# EAGLE design TRRS_Breakout-v10 (EAGLE 6.2)
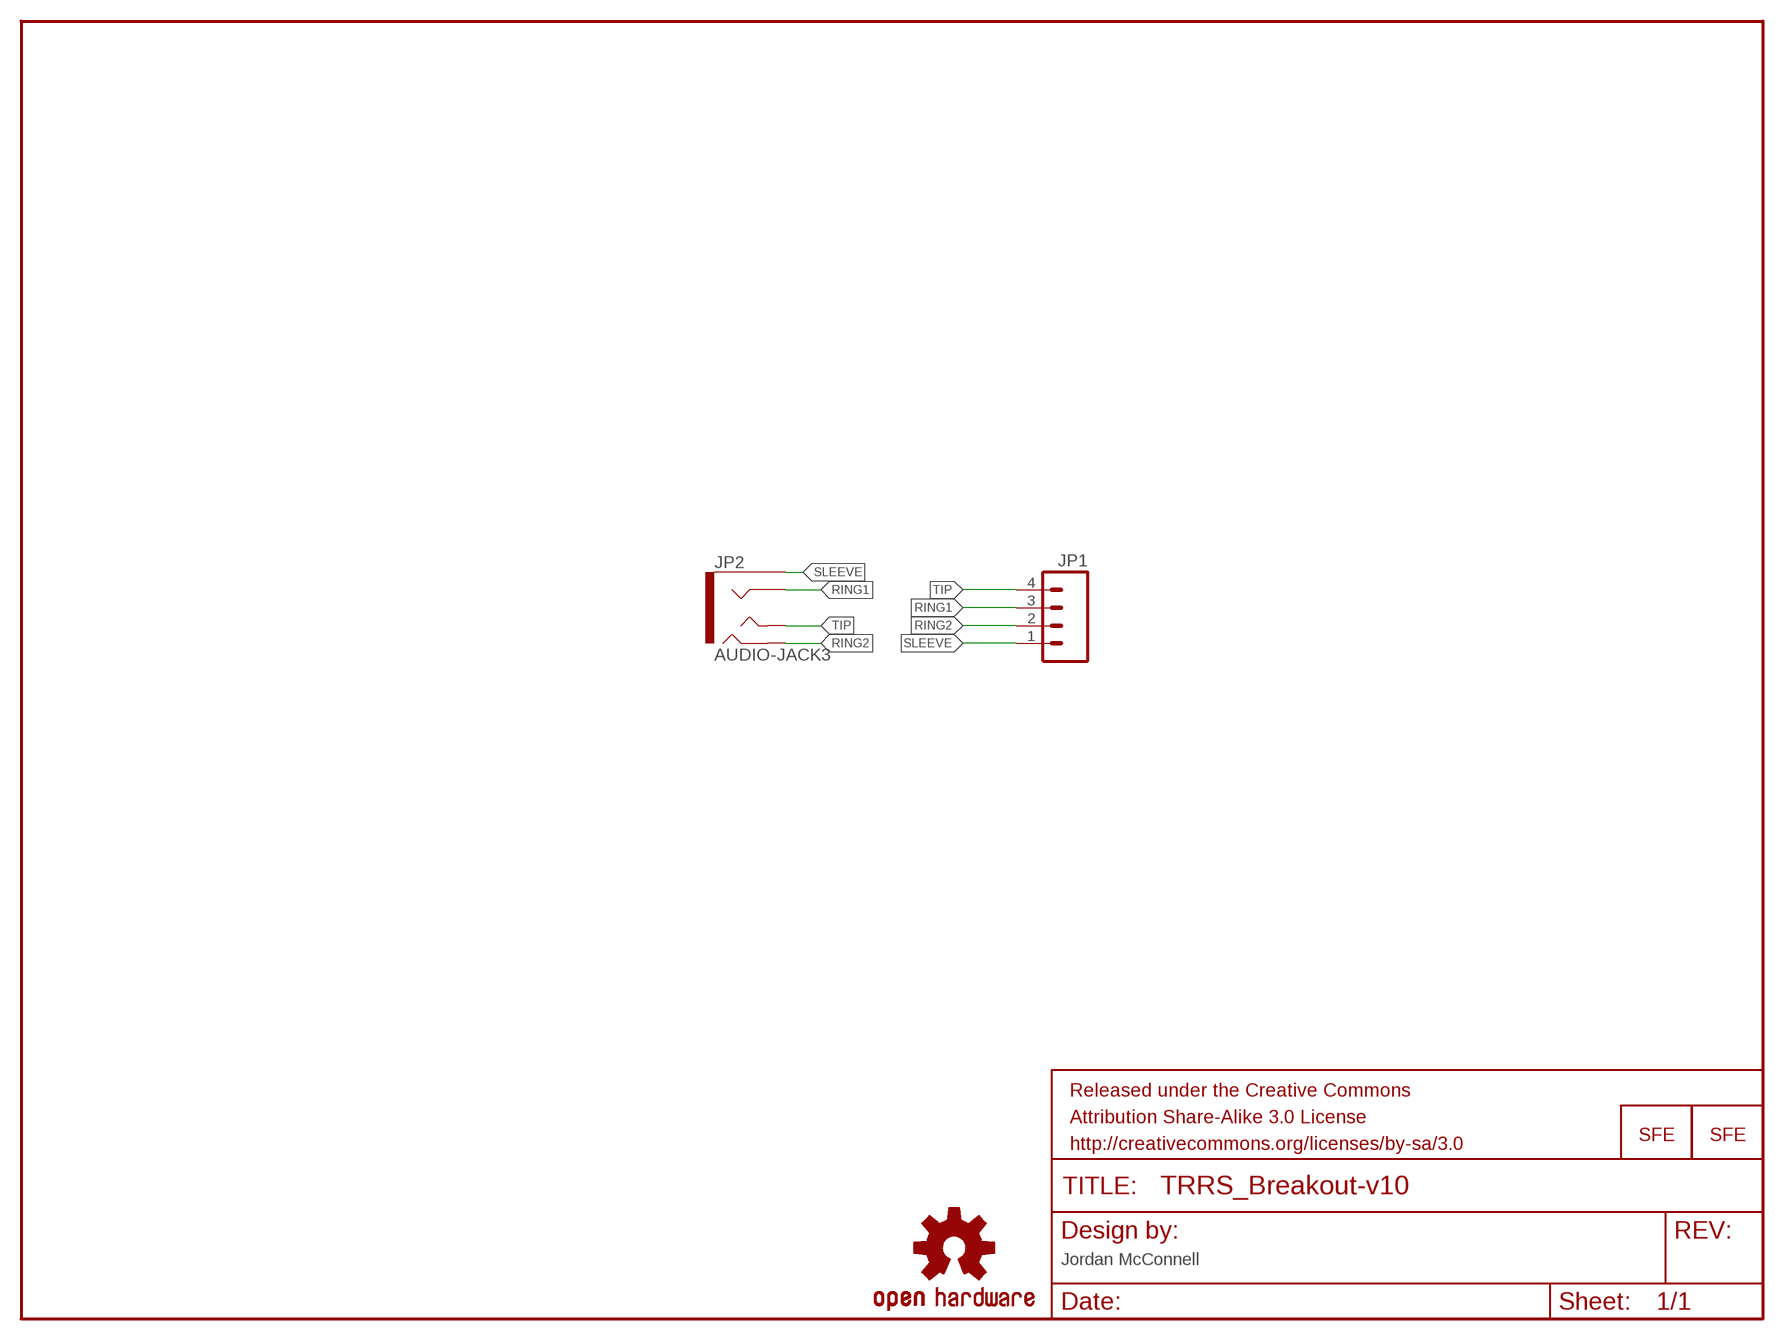
[diagram p0: schematic, sheet 1]

## Parts
FRAME1  FRAME-LETTER  [CREATIVE_COMMONS]
JP1  M04PTH  [1X04]
JP2  AUDIO-JACK3  [AUDIO-JACK-TRRS-SMD]
JP3  LOGO-SFESK  [SFE-LOGO-FLAME]
JP4  LOGO-SFESK  [SFE-LOGO-FLAME]
U$1  OSHW-LOGOS  [OSHW-LOGO-S]

## Nets
RING1: JP1.3 JP2.RING1
RING2: JP1.2 JP2.RING2
SLEEVE: JP1.1 JP2.EARTH
TIP: JP1.4 JP2.TIP

## Notes on the sheet
- Jordan McConnell

## Library data of the parts
FRAME1 = SparkFun-Aesthetics:FRAME-LETTER: Schematic Frame Standard 8.5x11 US Letter frame
JP1 = SparkFun-Connectors:M04: Header 4 Standard 4-pin 0.1" header. Use with straight break away headers (SKU : PRT-00116), right angle break away headers (PRT-00553), swiss pins (PRT-00743), machine pins (PRT-00117), and female headers (PRT-00115). Molex polarized connector foot print use with SKU : PRT-08231 with associated crimp pins and housings. 1MM SMD Version SKU: PRT-10208
JP2 = SparkFun-Connectors:AUDIO-JACK3: Audio jack - 3.5mm TRRS variety - two rings.
JP3 JP4 = SparkFun-Aesthetics:LOGO-SFE: Spark Fun Electronics PCB Logo This is the standard Spark Fun Electronics PCB logo.
U$1 = SparkFun-Aesthetics:OSHW-LOGO: Open Source Hardware Logo This logo indicates the piece of hardware it is found on incorporates a OSHW license and/or adheres to the definition of open source hardware found here: http://freedomdefined.org/OSHW

## Board
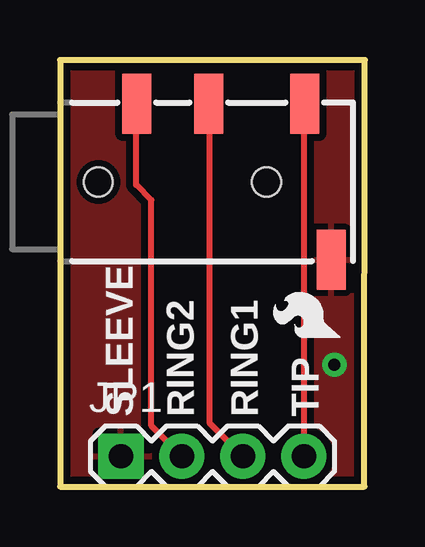
[diagram p1: board, top side]
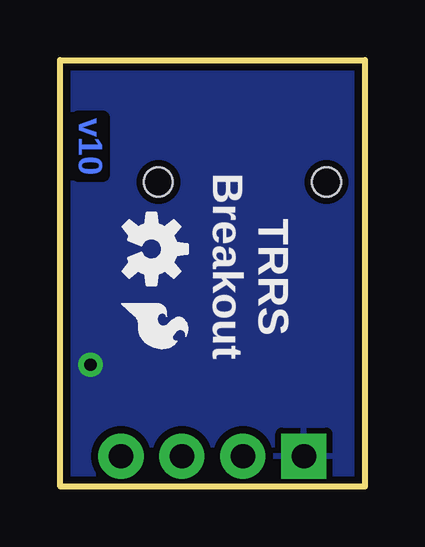
[diagram p2: board, bottom side, seen from below]

Size 12.7 x 17.78 mm. Coordinates in mm from the lower left corner, seen from the top.
Outline: 0,0 12.68,0 12.7,17.78 0,17.78 0,0
Copper layers (1*16): Top 0.035mm / dielectric 1.5mm / Bottom 0.035mm
Design rules: minimum track width 8mil, minimum drill 20mil, track to track 8mil, track to pad 8mil, pad to pad 8mil, via to via 8mil, smd to smd 8mil, copper to edge 8mil, drill to drill 8mil, minimum pad ring 12mil, minimum via ring 10mil, stop-mask expansion 4mil, vias tented up to drill 20mil, thermal gap 10mil

### Footprints (pad centres in the part's own frame; a part is rotated, then mirrored left to right if it is on the bottom)
1X04 = drill 1.016 pad 1.88 square: 1 0,0 | drill 1.016 pad 1.88: 2 2.54,0; 3 5.08,0; 4 7.62,0
AUDIO-JACK-TRRS-SMD = smd 1.2 x 2.5: EARTH 11.3,-3.25; RING1 6.2,3.25; RING2 3.2,3.25; TIP 10.2,3.25 | hole 1.2: 1.6,0; 8.6,0

### Placement (x,y rotation side)
FRAME1  -3.81,-11.43 0 top  (outside the outline)
JP1  2.54,1.27 0 top
JP2  0,12.7 0 top
JP3  11.68,6.22 90 top
JP4  10.16,7.62 270 bottom
U$1  8.89,9.91 270 bottom

### Tracks (layer width: path | path; a pad name or v marks a point on that pad's centre or on a via)
RING1
  Top 0.254: JP2.RING1 6.22,15.93 6.22,2.67 JP1.3
RING2
  Top 0.254: JP2.RING2 3.17,15.93 3.17,12.57 3.81,11.94 3.81,2.54 JP1.2
SLEEVE  (via drill 0.51)
  other vias: 11.43,5.08
  pour Top (isolate 0.305): 0,0 0,17.78 12.7,17.78 12.7,0
  pour Bottom (isolate 0.305): 0,0 0,17.78 12.7,17.78 12.7,0
TIP
  Top 0.254: JP2.TIP 10.16,15.91 JP1.4

### Text on the board
Bottom: v10
tPlace: SLEEVE | RING2 | RING1 | TIP
bPlace: Breakout | TRRS
tValues: Jordan McConnell